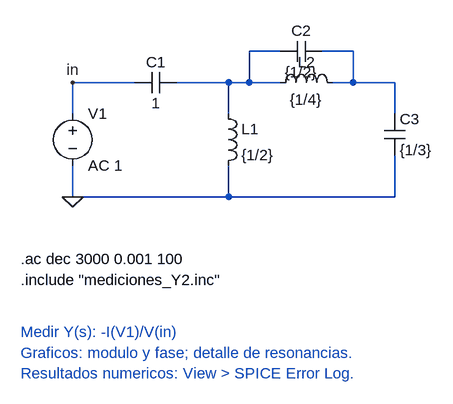
[diagram p0: schematic ejercicio2.asc]
ejercicio2.asc, the LTspice schematic file:
Version 4.1
SHEET 1 1000 760
WIRE 160 112 64 112
WIRE 304 112 224 112
WIRE 336 112 304 112
WIRE 336 64 336 112
WIRE 384 64 336 64
WIRE 496 64 448 64
WIRE 496 112 496 64
WIRE 384 112 336 112
WIRE 496 112 464 112
WIRE 560 112 496 112
WIRE 64 160 64 112
WIRE 304 160 304 112
WIRE 560 160 560 112
WIRE 64 288 64 240
WIRE 304 288 304 240
WIRE 304 288 64 288
WIRE 560 288 560 224
WIRE 560 288 304 288
FLAG 64 288 0
FLAG 64 112 in
SYMBOL voltage 64 144 R0
SYMATTR InstName V1
SYMATTR Value AC 1
SYMBOL cap 224 96 R90
WINDOW 0 0 32 VBottom 2
WINDOW 3 32 32 VTop 2
SYMATTR InstName C1
SYMATTR Value 1
SYMBOL ind 288 144 R0
SYMATTR InstName L1
SYMATTR Value {1/2}
SYMATTR SpiceLine Rser=0 Rpar=1e30
SYMBOL cap 448 48 R90
WINDOW 0 0 32 VBottom 2
WINDOW 3 32 32 VTop 2
SYMATTR InstName C2
SYMATTR Value {1/2}
SYMBOL ind 368 128 R270
WINDOW 0 32 56 VTop 2
WINDOW 3 5 56 VBottom 2
SYMATTR InstName L2
SYMATTR Value {1/4}
SYMATTR SpiceLine Rser=0 Rpar=1e30
SYMBOL cap 544 160 R0
SYMATTR InstName C3
SYMATTR Value {1/3}
TEXT -16 384 Left 2 !.ac dec 3000 0.001 100
TEXT -16 416 Left 2 !.include "mediciones_Y2.inc"
TEXT -16 496 Left 2 ;Medir Y(s): -I(V1)/V(in)
TEXT -16 528 Left 2 ;Graficos: modulo y fase; detalle de resonancias.
TEXT -16 560 Left 2 ;Resultados numericos: View > SPICE Error Log.

The netlist it stands for:
* ejercicio2.asc
V1 in 0 AC 1
C1 N001 in 1
L1 N001 0 {1/2} Rser=0 Rpar=1e30
C2 N002 N001 {1/2}
L2 N001 N002 {1/4} Rser=0 Rpar=1e30
C3 N002 0 {1/3}
.ac dec 3000 0.001 100
.include "mediciones_Y2.inc"
* Medir Y(s): -I(V1)/V(in)
* Graficos: modulo y fase; detalle de resonancias.
* Resultados numericos: View > SPICE Error Log.
.backanno
.end

* Results of the author's LTspice run, read from the files saved beside the schematic
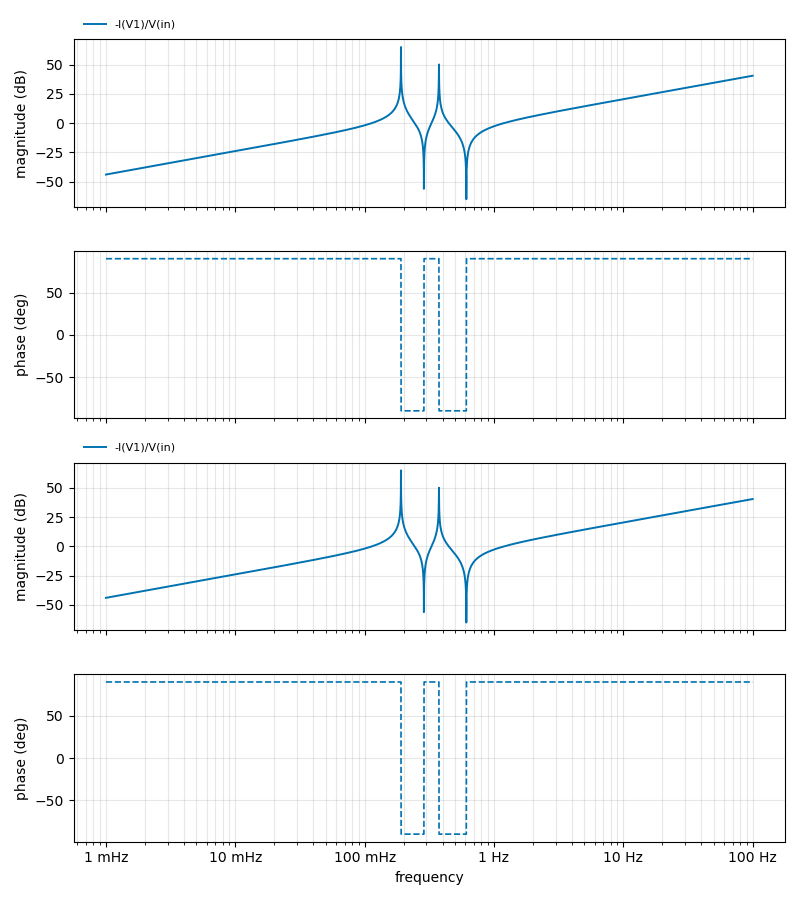
[diagram p1: AC Analysis of ejercicio2.asc, plotted from the saved traces]
* AC Analysis, 1 run:
*   -I(V1)/V(in): -44.04 dB at 1 mHz, 40.40 dB at 100 Hz, peak 64.92 dB at 190.8 mHz, 3 dB below the peak at 190.8 mHz and 190.9 mHz
*   -I(V1)/V(in): -44.04 dB at 1 mHz, 40.40 dB at 100 Hz, peak 64.92 dB at 190.8 mHz, 3 dB below the peak at 190.8 mHz and 190.9 mHz